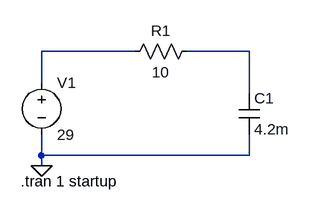
[diagram p0: schematic Draft4.asc]
Draft4.asc, the LTspice schematic file:
Version 4.1
SHEET 1 880 680
WIRE 144 112 0 112
WIRE 320 112 224 112
WIRE 0 160 0 112
WIRE 320 176 320 112
WIRE 0 272 0 240
WIRE 320 272 320 240
WIRE 320 272 0 272
WIRE 0 288 0 272
FLAG 0 288 0
SYMBOL voltage 0 144 R0
WINDOW 123 0 0 Left 0
WINDOW 39 0 0 Left 0
SYMATTR InstName V1
SYMATTR Value 29
SYMBOL res 128 128 R270
WINDOW 0 32 56 VTop 2
WINDOW 3 0 56 VBottom 2
SYMATTR InstName R1
SYMATTR Value 10
SYMBOL cap 304 176 R0
SYMATTR InstName C1
SYMATTR Value 4.2m
TEXT -32 312 Left 2 !.tran 1 startup

The netlist it stands for:
* Draft4.asc
V1 N001 0 29
R1 N001 N002 10
C1 N002 0 4.2m
.tran 1 startup
.backanno
.end